# EAGLE design 0805 Breakout Board (EAGLE 8.4.1)
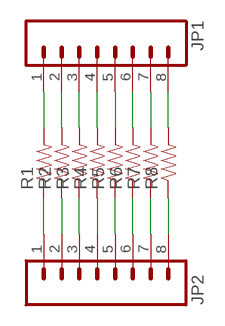
[diagram p0: schematic, sheet 1]

## Parts
JP1  M08  [1X08]
JP2  M08  [1X08]
R1  RESISTOR0805-RES  [0805]
R2  RESISTOR0805-RES  [0805]
R3  RESISTOR0805-RES  [0805]
R4  RESISTOR0805-RES  [0805]
R5  RESISTOR0805-RES  [0805]
R6  RESISTOR0805-RES  [0805]
R7  RESISTOR0805-RES  [0805]
R8  RESISTOR0805-RES  [0805]

## Nets
N$1: JP1.1 R1.2
N$2: JP2.8 R8.1
N$3: JP2.7 R7.1
N$4: JP1.2 R2.2
N$5: JP2.6 R6.1
N$6: JP1.3 R3.2
N$7: JP2.5 R5.1
N$8: JP1.4 R4.2
N$9: JP1.5 R5.2
N$10: JP2.4 R4.1
N$11: JP2.3 R3.1
N$12: JP1.6 R6.2
N$13: JP1.7 R7.2
N$14: JP2.2 R2.1
N$15: JP2.1 R1.1
N$16: JP1.8 R8.2

## Library data of the parts
JP1 JP2 = HyTechDevices:M08: Standard 8-pin 0.1" header. NOTES ON THE VARIANTS LOCK and LOCK_LONGPADS... This footprint was designed to help hold the alignment of a through-hole component (i.e. 6-pin header) while soldering it into place. You may notice that each hole has been shifted either up or down by 0.005 of an inch from it's more standard position (which is a perfectly straight line). This slight alteration caused the pins (the squares in the middle) to touch the edges of the holes. Because they are alternating, it causes a "brace" to hold the component in place. 0.005 has proven to be the perfect amount of "off-center" position when using our standard breakaway headers. Although looks a little odd when you look at the bare footprint, once you have a header in there, the alteration is very hard to notice. Also,if you push a header all the way into place, it is covered up entirely on the bottom side. This idea of altering the position of holes to aid alignment will be further integrated into the Sparkfun Library for other footprints. It can help hold any component with 3 or more connection pins. Note: The Sparkfun version includes many other packages including surface mount that may be of future interest. Source: Sparkfun <https://github.com/sparkfun/SparkFun-Eagle-Libraries>
R1-R8 = HyTechDevices:RESISTOR: Resistor Basic schematic elements and footprints for 0603, 1206, and PTH resistors.

## Board
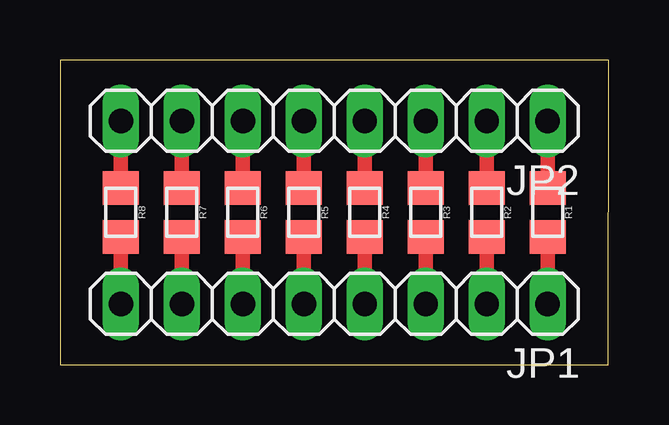
[diagram p1: board, top side]

Size 22.86 x 12.7 mm. Coordinates in mm from the lower left corner, seen from the top.
Outline: 0,0 22.84,0 22.86,12.7 0,12.7 0,0
Copper layers (1*16): Top 0.035mm / dielectric 1.5mm / Bottom 0.035mm
Design rules "default": minimum track width 6mil, minimum drill 0.35mm, track to track 6mil, track to pad 6mil, pad to pad 6mil, via to via 6mil, smd to smd 6mil, copper to edge 40mil, drill to drill 6mil, minimum pad ring 10mil, minimum via ring 8mil, stop-mask expansion 4mil, vias tented up to drill 0mil, thermal gap 10mil

### Footprints (pad centres in the part's own frame; a part is rotated, then mirrored left to right if it is on the bottom)
1X08 = drill 1.016 long: 1 -8.89,0; 2 -6.35,0; 3 -3.81,0; 4 -1.27,0; 5 1.27,0; 6 3.81,0; 7 6.35,0; 8 8.89,0
0805 = smd 1.4 x 1.5: 1 -1.025,0; 2 1.025,0

### Placement (x,y rotation side)
JP1  11.43,2.54 180 top
JP2  11.43,10.16 180 top
R1  20.32,6.35 270 top
R2  17.78,6.35 270 top
R3  15.24,6.35 270 top
R4  12.7,6.35 270 top
R5  10.16,6.35 270 top
R6  7.62,6.35 270 top
R7  5.08,6.35 270 top
R8  2.54,6.35 270 top

### Tracks (layer width: path | path; a pad name or v marks a point on that pad's centre or on a via)
N$1
  Top 0.61: JP1.1 R1.2
N$2
  Top 0.61: R8.1 JP2.8
N$3
  Top 0.61: R7.1 JP2.7
N$4
  Top 0.61: JP1.2 R2.2
N$5
  Top 0.61: JP2.6 R6.1
N$6
  Top 0.61: JP1.3 R3.2
N$7
  Top 0.61: JP2.5 R5.1
N$8
  Top 0.61: JP1.4 R4.2
N$9
  Top 0.61: JP1.5 R5.2
N$10
  Top 0.61: JP2.4 R4.1
N$11
  Top 0.61: JP2.3 R3.1
N$12
  Top 0.61: JP1.6 R6.2
N$13
  Top 0.61: JP1.7 R7.2
N$14
  Top 0.61: JP2.2 R2.1
N$15
  Top 0.61: JP2.1 R1.1
N$16
  Top 0.61: JP1.8 R8.2